# EAGLE design i2c2midi_board (EAGLE 9.6.2)
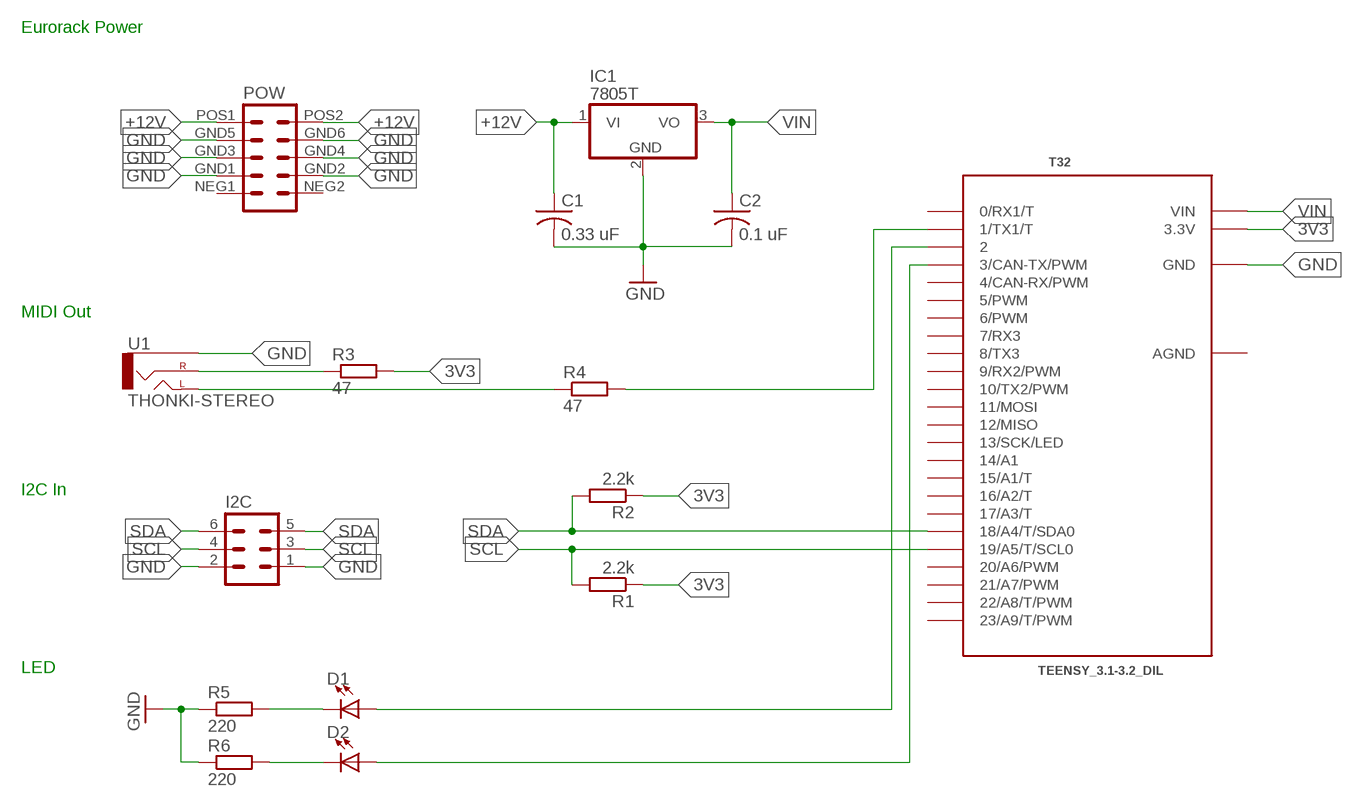
[diagram p0: schematic, sheet 1]

## Parts
C1  0.33 uF  C-US050-025X075  [C050-025X075]
C2  0.1 uF  C-US050-025X075  [C050-025X075]
D1  LED3MM  [LED3MM]
D2  LED3MM  [LED3MM]
I2C  MA03-2BACKSIDEFRONTSIDE  [MA03-2]
IC1  7805T  [TO220H]
POW  EURO_POWER_HEADERLOCK_PADS  [EURO_PWR_HEADER_LOCK]
R1  2.2k  RESISTOR10MM_RESISTOR  [10MM_RESISTOR]
R2  2.2k  RESISTOR10MM_RESISTOR  [10MM_RESISTOR]
R3  47  RESISTOR10MM_RESISTOR  [10MM_RESISTOR]
R4  47  RESISTOR10MM_RESISTOR  [10MM_RESISTOR]
R5  220  RESISTOR10MM_RESISTOR  [10MM_RESISTOR]
R6  220  RESISTOR10MM_RESISTOR  [10MM_RESISTOR]
T32  TEENSY_3.1-3.2_DIL  [TEENSY_3.0-3.2&LC_DIL]
U1  THONKI-STEREO  [WQP-PJ366ST_JACK]

## Nets
3V3: R1.1 R2.1 R3.2 T32.3.3V
+12V: C1.1 IC1.1(VI) POW.POS1 POW.POS2
GND: C1.2 C2.2 I2C.1 I2C.2 IC1.2(GND) POW.GND1 POW.GND2 POW.GND3 POW.GND4 POW.GND5 POW.GND6 R5.1 R6.1 T32.GND U1.P$3_SLEEVE(SLEEVE)
N$1: R3.1 U1.P$2_SWITCH(RIGHT)
N$3: D2.K(C) R6.2
N$4: R4.2 T32.1(1/TX1/T)
N$5: R4.1 U1.P$1_TIP(LEFT)
N$6: D1.K(C) R5.2
N$7: D1.A T32.2
N$8: D2.A T32.3(3/CAN-TX/PWM)
SCL: I2C.3 I2C.4 R1.2 T32.19/A5(19/A5/T/SCL0)
SDA: I2C.5 I2C.6 R2.2 T32.18/A4(18/A4/T/SDA0)
VIN: C2.1 IC1.3(VO) T32.VIN
Unconnected: POW.NEG1 POW.NEG2 T32.0(0/RX1/T) T32.4(4/CAN-RX/PWM) T32.5(5/PWM) T32.6(6/PWM) T32.7(7/RX3) T32.8(8/TX3) T32.9(9/RX2/PWM) T32.10(10/TX2/PWM) T32.11(11/MOSI) T32.12(12/MISO) T32.13(13/SCK/LED) T32.14/A0(14/A1) T32.15/A1(15/A1/T) T32.16/A2(16/A2/T) T32.17/A3(17/A3/T) T32.20/A6(20/A6/PWM) T32.21/A7(21/A7/PWM) T32.22/A8(22/A8/T/PWM) T32.23/A9(23/A9/T/PWM)

## Notes on the sheet
- Eurorack Power
- MIDI Out
- I2C In
- LED

## Power pins joined to a net without a drawn wire
AGND: T32.AGND

## Library data of the parts
C1 C2 = adafruit_jh1:C-US: CAPACITOR, American symbol
D1 D2 = adafruit:LED: LED OSRAM: - CHIPLED LG R971, LG N971, LY N971, LG Q971, LY Q971, LO R971, LY R971 LH N974, LH R974 LS Q976, LO Q976, LY Q976 LO Q996 - Hyper CHIPLED LW Q18S LB Q993, LB Q99A, LB R99A - SideLED LS A670, LO A670, LY A670, LG A670, LP A670 LB A673, LV A673, LT A673, LW A673 LH A674 LY A675 LS A676, LA A676, LO A676, LY A676, LW A676 LS A679, LY A679, LG A679 - Hyper Micro SIDELED® LS Y876, LA Y876, LO Y876, LY Y876 LT Y87S - SmartLED LW L88C, LW L88S LB L89C, LB L89S, LG L890 LS L89K, LO L89K, LY L89K LS L896, LA L896, LO L896, LY L896 - TOPLED LS T670, LO T670, LY T670, LG T670, LP T670 LSG T670, LSP T670, LSY T670, LOP T670, LYG T670 LG T671, LOG T671, LSG T671 LB T673, LV T673, LT T673, LW T673 LH T674 LS T676, LA T676, LO T676, LY T676, LB T676, LH T676, LSB T676, LW T676 LB T67C, LV T67C, LT T67C, LS T67K, LO T67K, LY T67K, LW E67C LS E67B, LA E67B, LO E67B, LY E67B, LB E67C, LV E67C, LT E67C LW T67C LS T679, LY T679, LG T679 LS T770, LO T770, LY T770, LG T770, LP T770 LB T773, LV T773, LT T773, LW T773 LH T774 LS E675, LA E675, LY E675, LS T675 LS T776, LA T776, LO T776, LY T776, LB T776 LHGB T686 LT T68C, LB T68C - Hyper Mini TOPLED® LB M676 - Mini TOPLED Santana® LG M470 LS M47K, LO M47K, LY M47K Source: http://www.osram.convergy.de/
I2C = MusicThingModular:MA03-2BACKSIDE: PIN HEADER; OC_FARNELL: unknown; OC_NEWARK: unknown
IC1 = adafruit_jh1:78*: Positive VOLTAGE REGULATOR Added bigger pads to the TO-92 package
POW = attowatt:EURO_POWER_HEADER: Power Header 10 pin power header for Eurorack Power Supplies Variants with fatter pads for easier soldering, and the LOCK variant which has 5mil offset pins to hold the component in place before soldering
R1-R6 = MusicThingModular:RESISTOR: Standard resistor, various versions
T32 = Teensy_3_and_LC_Series_Boards_v1.4:TEENSY_3.1-3.2_DIL: Teensy 3.1 or 3.2 in a DIL Layout.
U1 = MusicThingModular:THONKI-STEREO: 3.5mm socket for Eurorack modular synths

## Board
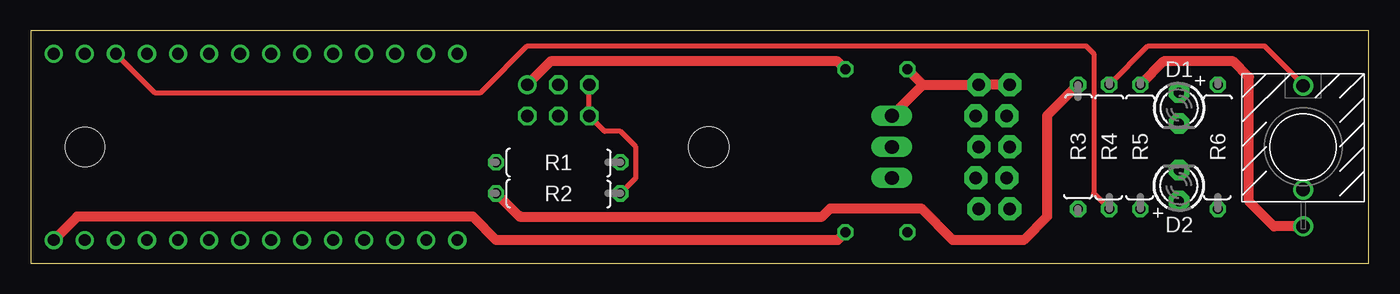
[diagram p1: board, top side]
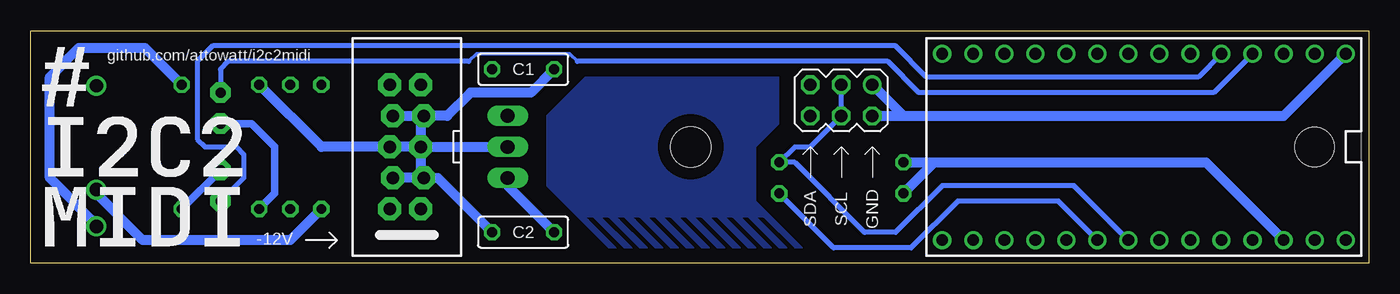
[diagram p2: board, bottom side, seen from below]

Size 109.53 x 19.04 mm. Coordinates in mm from the lower left corner, seen from the top.
Outline: 0,0 109.53,0 109.53,19.04 0,19.04 0,0
Copper layers (1*16): Top 0.035mm / dielectric 1.5mm / Bottom 0.035mm
Design rules "default": minimum track width 6mil, minimum drill 0.35mm, track to track 6mil, track to pad 6mil, pad to pad 6mil, via to via 6mil, smd to smd 6mil, copper to edge 40mil, drill to drill 6mil, minimum pad ring 10mil, minimum via ring 8mil, stop-mask expansion 4mil, vias tented up to drill 0mil, thermal gap 10mil
Holes 3.2 mm at 4.45,9.53

### Footprints (pad centres in the part's own frame; a part is rotated, then mirrored left to right if it is on the bottom)
C050-025X075 = drill 0.813 octagon: 1 -2.54,0; 2 2.54,0
LED3MM = drill 0.813 pad 1.676 octagon: A -1.27,0; K 1.27,0
MA03-2 = drill 1.016: 1 -2.54,-1.27 | drill 1.016 octagon: 2 -2.54,1.27; 3 0,-1.27; 4 0,1.27; 5 2.54,-1.27; 6 2.54,1.27
TO220H = drill 1.118 long: 1 -2.54,-10.16; 2 0,-10.16; 3 2.54,-10.16 | hole 3.302: 0,4.826
EURO_PWR_HEADER_LOCK = drill 1.016 pad 1.88 octagon: GND1 -2.54,1.143; GND2 -2.54,-1.397; GND3 0,1.397; GND4 0,-1.143; GND5 2.54,1.143; GND6 2.54,-1.397; NEG1 -5.08,1.397; NEG2 -5.08,-1.143; POS1 5.08,1.397; POS2 5.08,-1.143
10MM_RESISTOR = drill 0.813 octagon: 1 -5.08,0; 2 5.08,0
TEENSY_3.0-3.2&LC_DIL = drill 0.965: 0 -7.62,13.97; 1 -7.62,11.43; 2 -7.62,8.89; 3 -7.62,6.35; 3.3V 7.62,11.43; 4 -7.62,3.81; 5 -7.62,1.27; 6 -7.62,-1.27; 7 -7.62,-3.81; 8 -7.62,-6.35; 9 -7.62,-8.89; 10 -7.62,-11.43; 11 -7.62,-13.97; 12 -7.62,-16.51; 13 7.62,-16.51; 14/A0 7.62,-13.97; 15/A1 7.62,-11.43; 16/A2 7.62,-8.89; 17/A3 7.62,-6.35; 18/A4 7.62,-3.81; 19/A5 7.62,-1.27; 20/A6 7.62,1.27; 21/A7 7.62,3.81; 22/A8 7.62,6.35; 23/A9 7.62,8.89; AGND 7.62,13.97; GND -7.62,16.51; VIN 7.62,16.51
WQP-PJ366ST_JACK = drill 1.1: P$1_TIP 0,5; P$2_SWITCH 0,-3.5; P$3_SLEEVE 0,-6.5

### Placement (x,y rotation side)
C1  69.22,15.88 0 bottom
C2  69.22,2.54 180 bottom
D1  93.98,12.7 270 top
D2  93.98,6.35 90 top
I2C  43.18,13.34 180 bottom
IC1  60.33,9.53 270 bottom
POW  78.74,9.53 90 bottom
R1  43.18,8.26 0 top
R2  43.18,5.71 0 top
R3  85.72,9.53 90 top
R4  88.27,9.53 270 top
R5  90.81,9.53 270 top
R6  97.16,9.53 270 top
T32  18.41,9.53 270 bottom
U1  104.14,9.53 0 top

### Tracks (layer width: path | path; a pad name or v marks a point on that pad's centre or on a via)
3V3
  Top 0.813: R3.2 83.19,12.06 83.19,3.81 81.28,1.91 75.48,1.91 72.89,4.5 65.46,4.5 64.77,3.81 40.01,3.81 | 40.06,3.86 40.01,3.81 | 40.01,3.81 R2.1
  Bottom 0.813: R2.1 35.56,8.26 | 35.56,8.26 13.34,8.26 T32.3.3V | R1.1 35.56,8.26
+12V
  Top 0.813: POW.POS1 POW.POS2 73.03,14.61 | IC1.1 73.03,14.61 | 73.03,14.61 C1.1
GND
  Top 0.813: U1.P$3_SLEEVE 101.75,3.02 99.69,5.08 99.69,15.24 98.42,16.51 92.71,16.51 R5.1 | C1.2 66.04,16.51 42.55,16.51 I2C.1
  Bottom 0.813: POW.GND4 IC1.2 | POW.GND2 76.2,6.99 C2.2 | C1.2 68.58,13.97 73.53,13.97 75.44,12.06 POW.GND6 | I2C.2 38.1,12.06 | 38.1,12.06 6.99,12.06 T32.GND | I2C.1 38.1,12.06 | POW.GND5 POW.GND6 | POW.GND6 77.6,11.81 POW.GND4 | POW.GND4 POW.GND3 85.72,9.53 R5.1 | POW.GND4 77.6,7.24 POW.GND2 | POW.GND2 POW.GND1 | U1.P$3_SLEEVE 104.14,3.17 107.95,6.99 107.95,15.24 105.57,17.62 100.17,17.62 R6.1
HEAT
  pour Bottom: 67.31,12.06 67.31,6.35 62.23,1.27 61.59,1.27 64.14,3.81 63.5,3.81 60.96,1.27 60.33,1.27 62.87,3.81 62.23,3.81 59.69,1.27 59.05,1.27 61.59,3.81 60.96,3.81 58.42,1.27 57.78,1.27 60.33,3.81 59.69,3.81 57.15,1.27 56.52,1.27 59.05,3.81 58.42,3.81 55.88,1.27 55.24,1.27 57.78,3.81 57.15,3.81 54.61,1.27 53.98,1.27 56.52,3.81 55.88,3.81 53.34,1.27 52.7,1.27 55.24,3.81 54.61,3.81 52.07,1.27 51.44,1.27 53.98,3.81 53.34,3.81 50.8,1.27 50.16,1.27 52.7,3.81 52.07,3.81 49.53,1.27 48.9,1.27 51.44,3.81 50.8,3.81 48.26,1.27 47.62,1.27 50.16,3.81 49.53,3.81 46.99,1.27 46.35,1.27 50.16,5.08 50.16,9.53 48.26,11.43 48.26,15.24 64.14,15.24
N$1
  Bottom 0.813: R3.1 88.27,1.91 100.33,1.91 104.14,5.71 U1.P$2_SWITCH
N$3
  Bottom 0.61: R6.2 D2.K
N$4
  Top 0.406: R4.2 87,5.71 87,17.14 86.36,17.78 40.64,17.78 37.15,14.29 36.83,13.97 10.16,13.97 T32.1
N$5
  Top 0.406: R4.1 91.44,17.78 100.97,17.78 104.14,14.61
  Top 0.61: 104.14,14.61 U1.P$1_TIP
N$6
  Bottom 0.61: D1.K 91.44,11.43 89.53,9.53 89.53,5.71 R5.2
N$7
  Bottom 0.305: 64.77,16.51 65.41,17.14 73.03,17.14 73.66,16.51
  Bottom 0.406: T32.2 12.7,13.97 36.83,13.97 39.37,16.51 64.77,16.51 | 73.66,16.51 93.34,16.51 93.98,15.88 D1.A
N$8
  Bottom 0.406: T32.3 13.97,15.24 36.2,15.24 38.73,17.78 94.61,17.78 95.89,16.51 95.89,10.16 95.25,9.53 92.71,9.53 92.08,8.89 92.08,6.99 D2.A
SCL
  Bottom 0.406: T32.19/A5 24.13,6.35 34.92,6.35 38.73,2.54 41.27,2.54 46.99,8.26 R1.2 46.99,9.53 45.72,9.53 I2C.4 I2C.3
SDA
  Top 0.406: R2.2 49.53,6.99 49.53,9.53 48.26,10.79 46.99,10.79 I2C.6 I2C.5
  Bottom 0.406: R2.2 43.81,1.27 37.47,1.27 33.66,5.08 25.4,5.08 T32.18/A4
VIN
  Top 0.813: T32.VIN 3.81,3.81 36.2,3.81 38.1,1.91 66.04,1.91 C2.1
  Bottom 0.813: C2.1 70.48,6.35 IC1.3

### Text on the board
bPlace: github.com/attowatt/i2c2midi | GND | SCL | SDA | -12V